# EAGLE schematic ESP32 Watch-2.01 inch V1.0 (EAGLE 9.6.2)
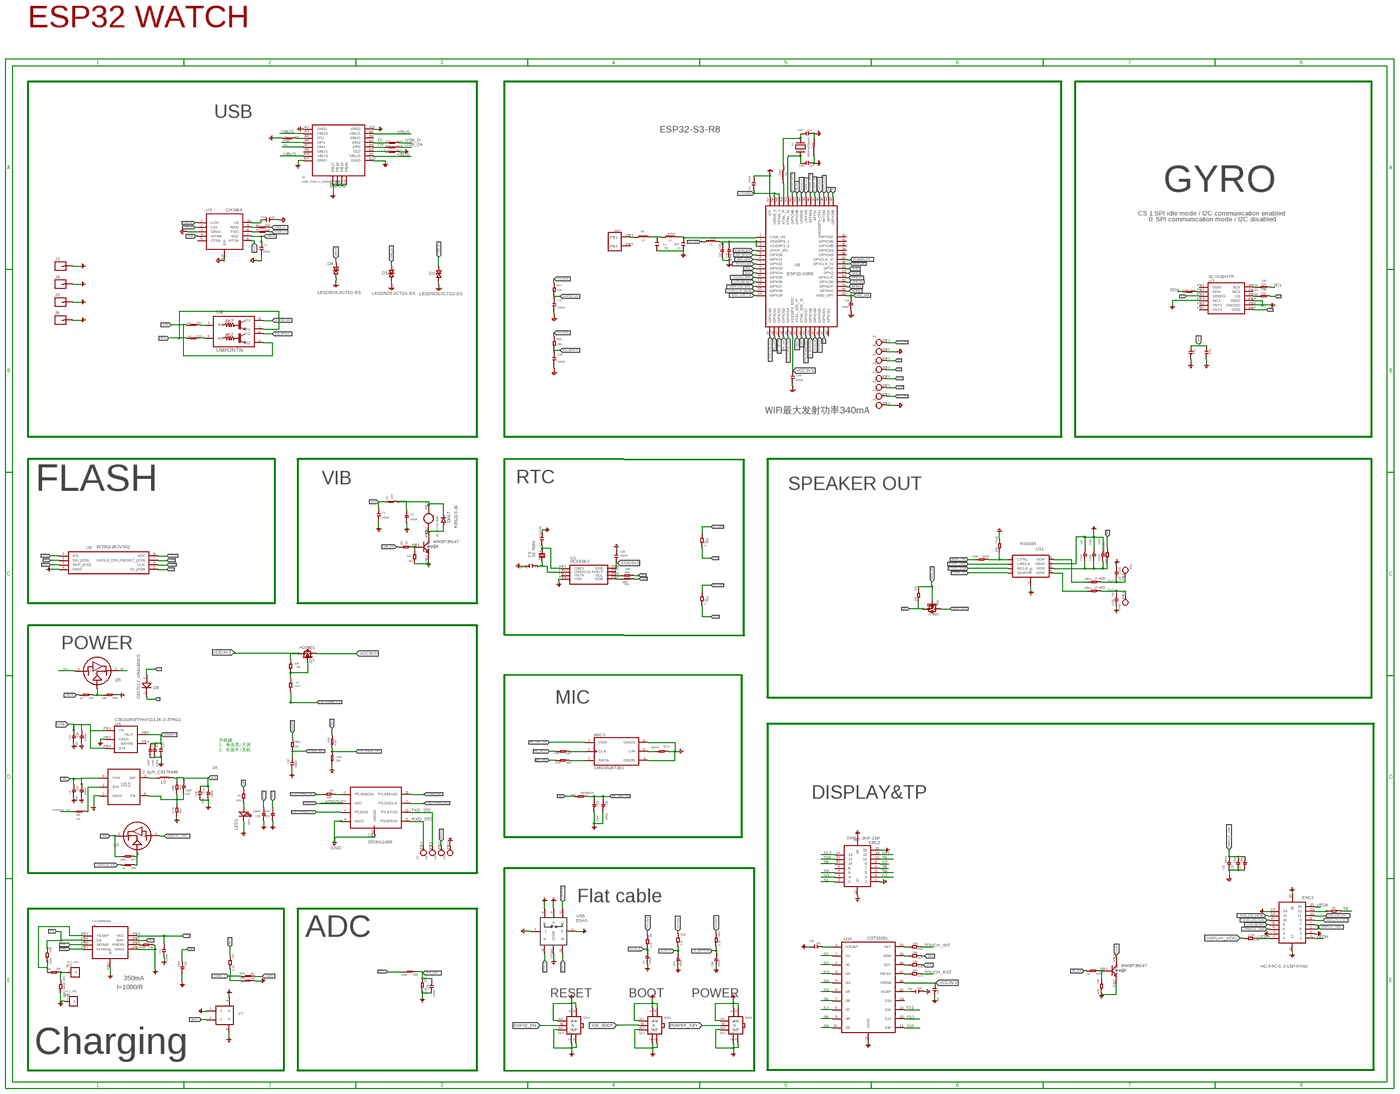
[diagram p0: schematic, sheet 1, overview]
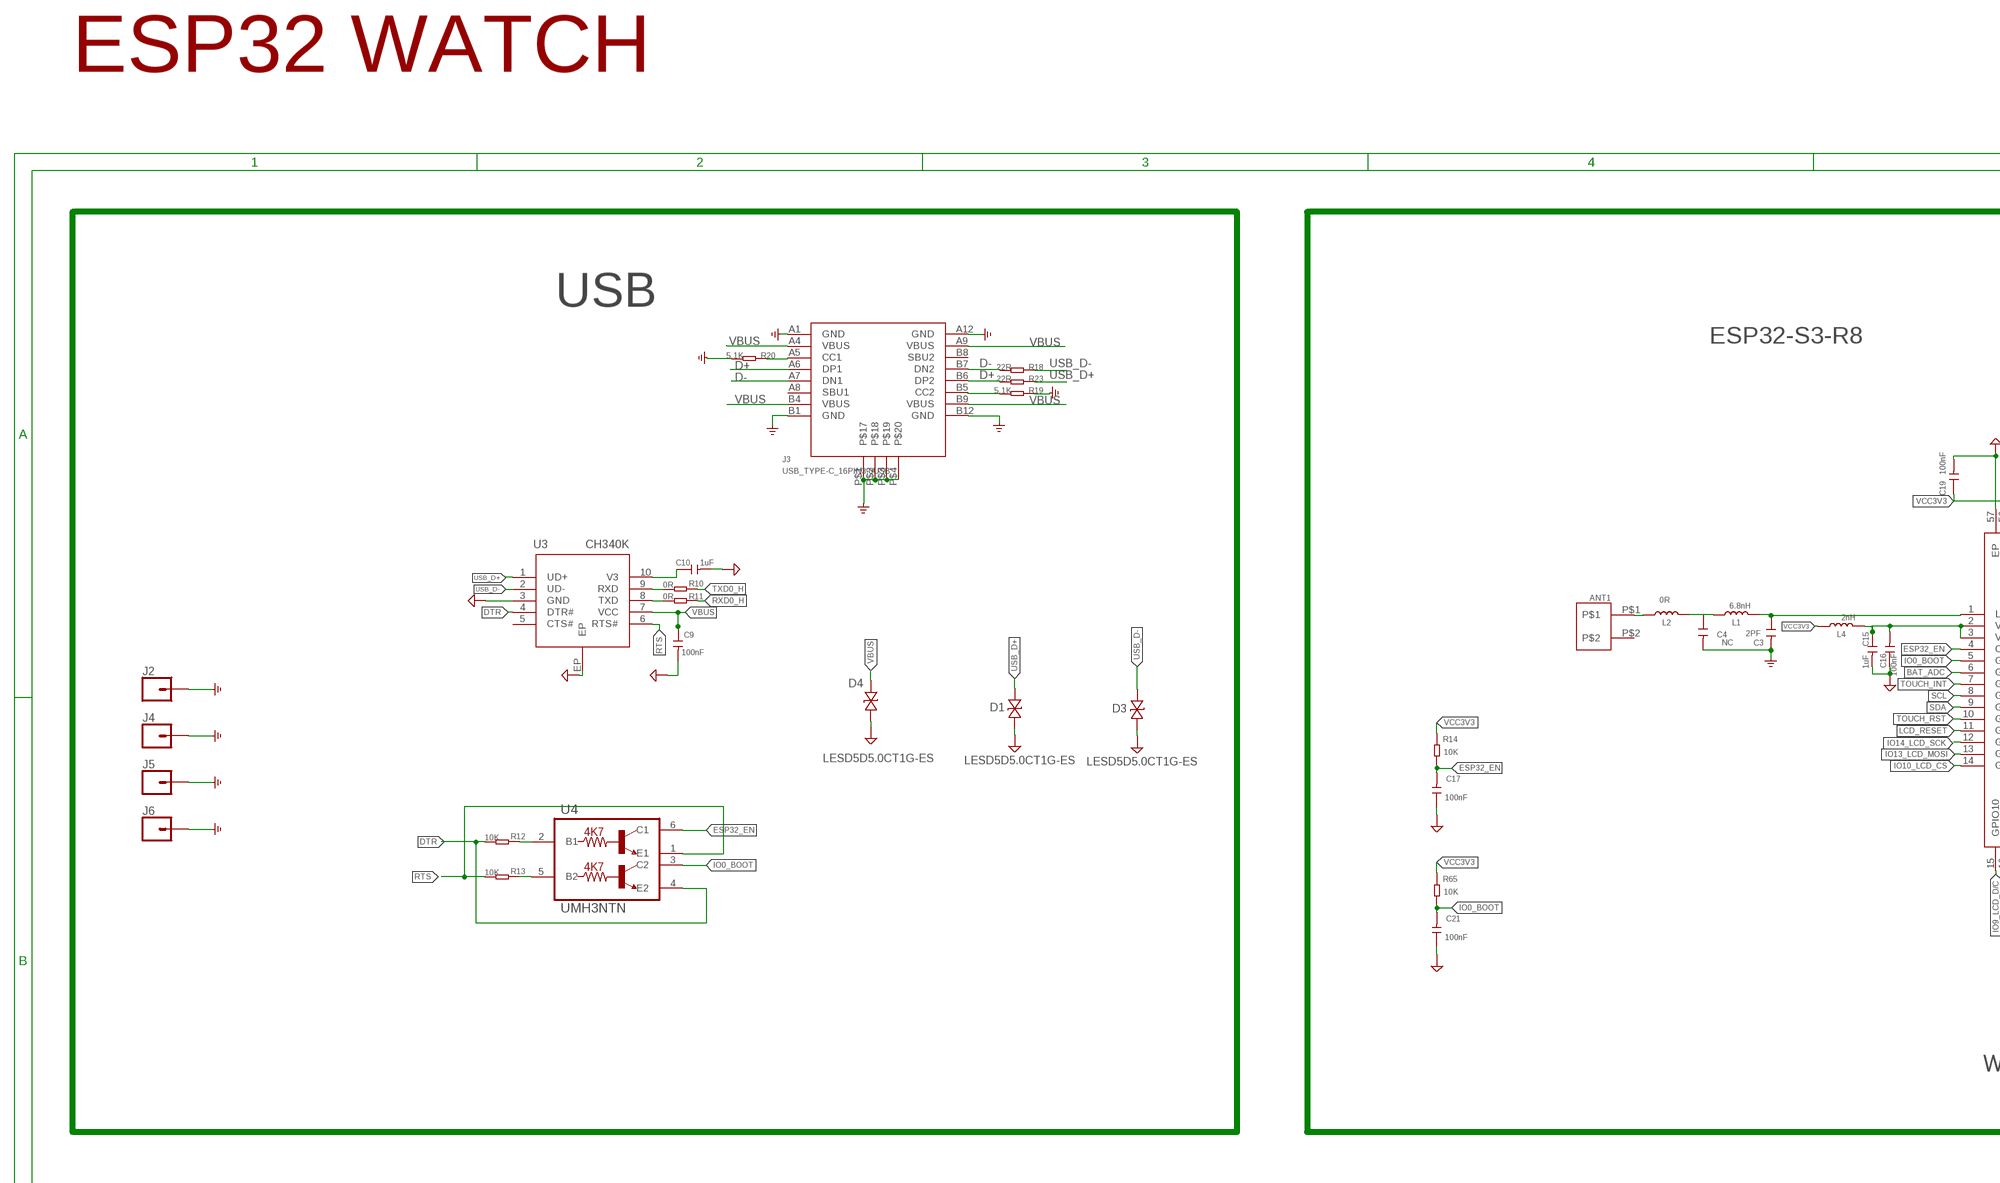
[diagram p1: schematic, sheet 1, part 1 of 4]
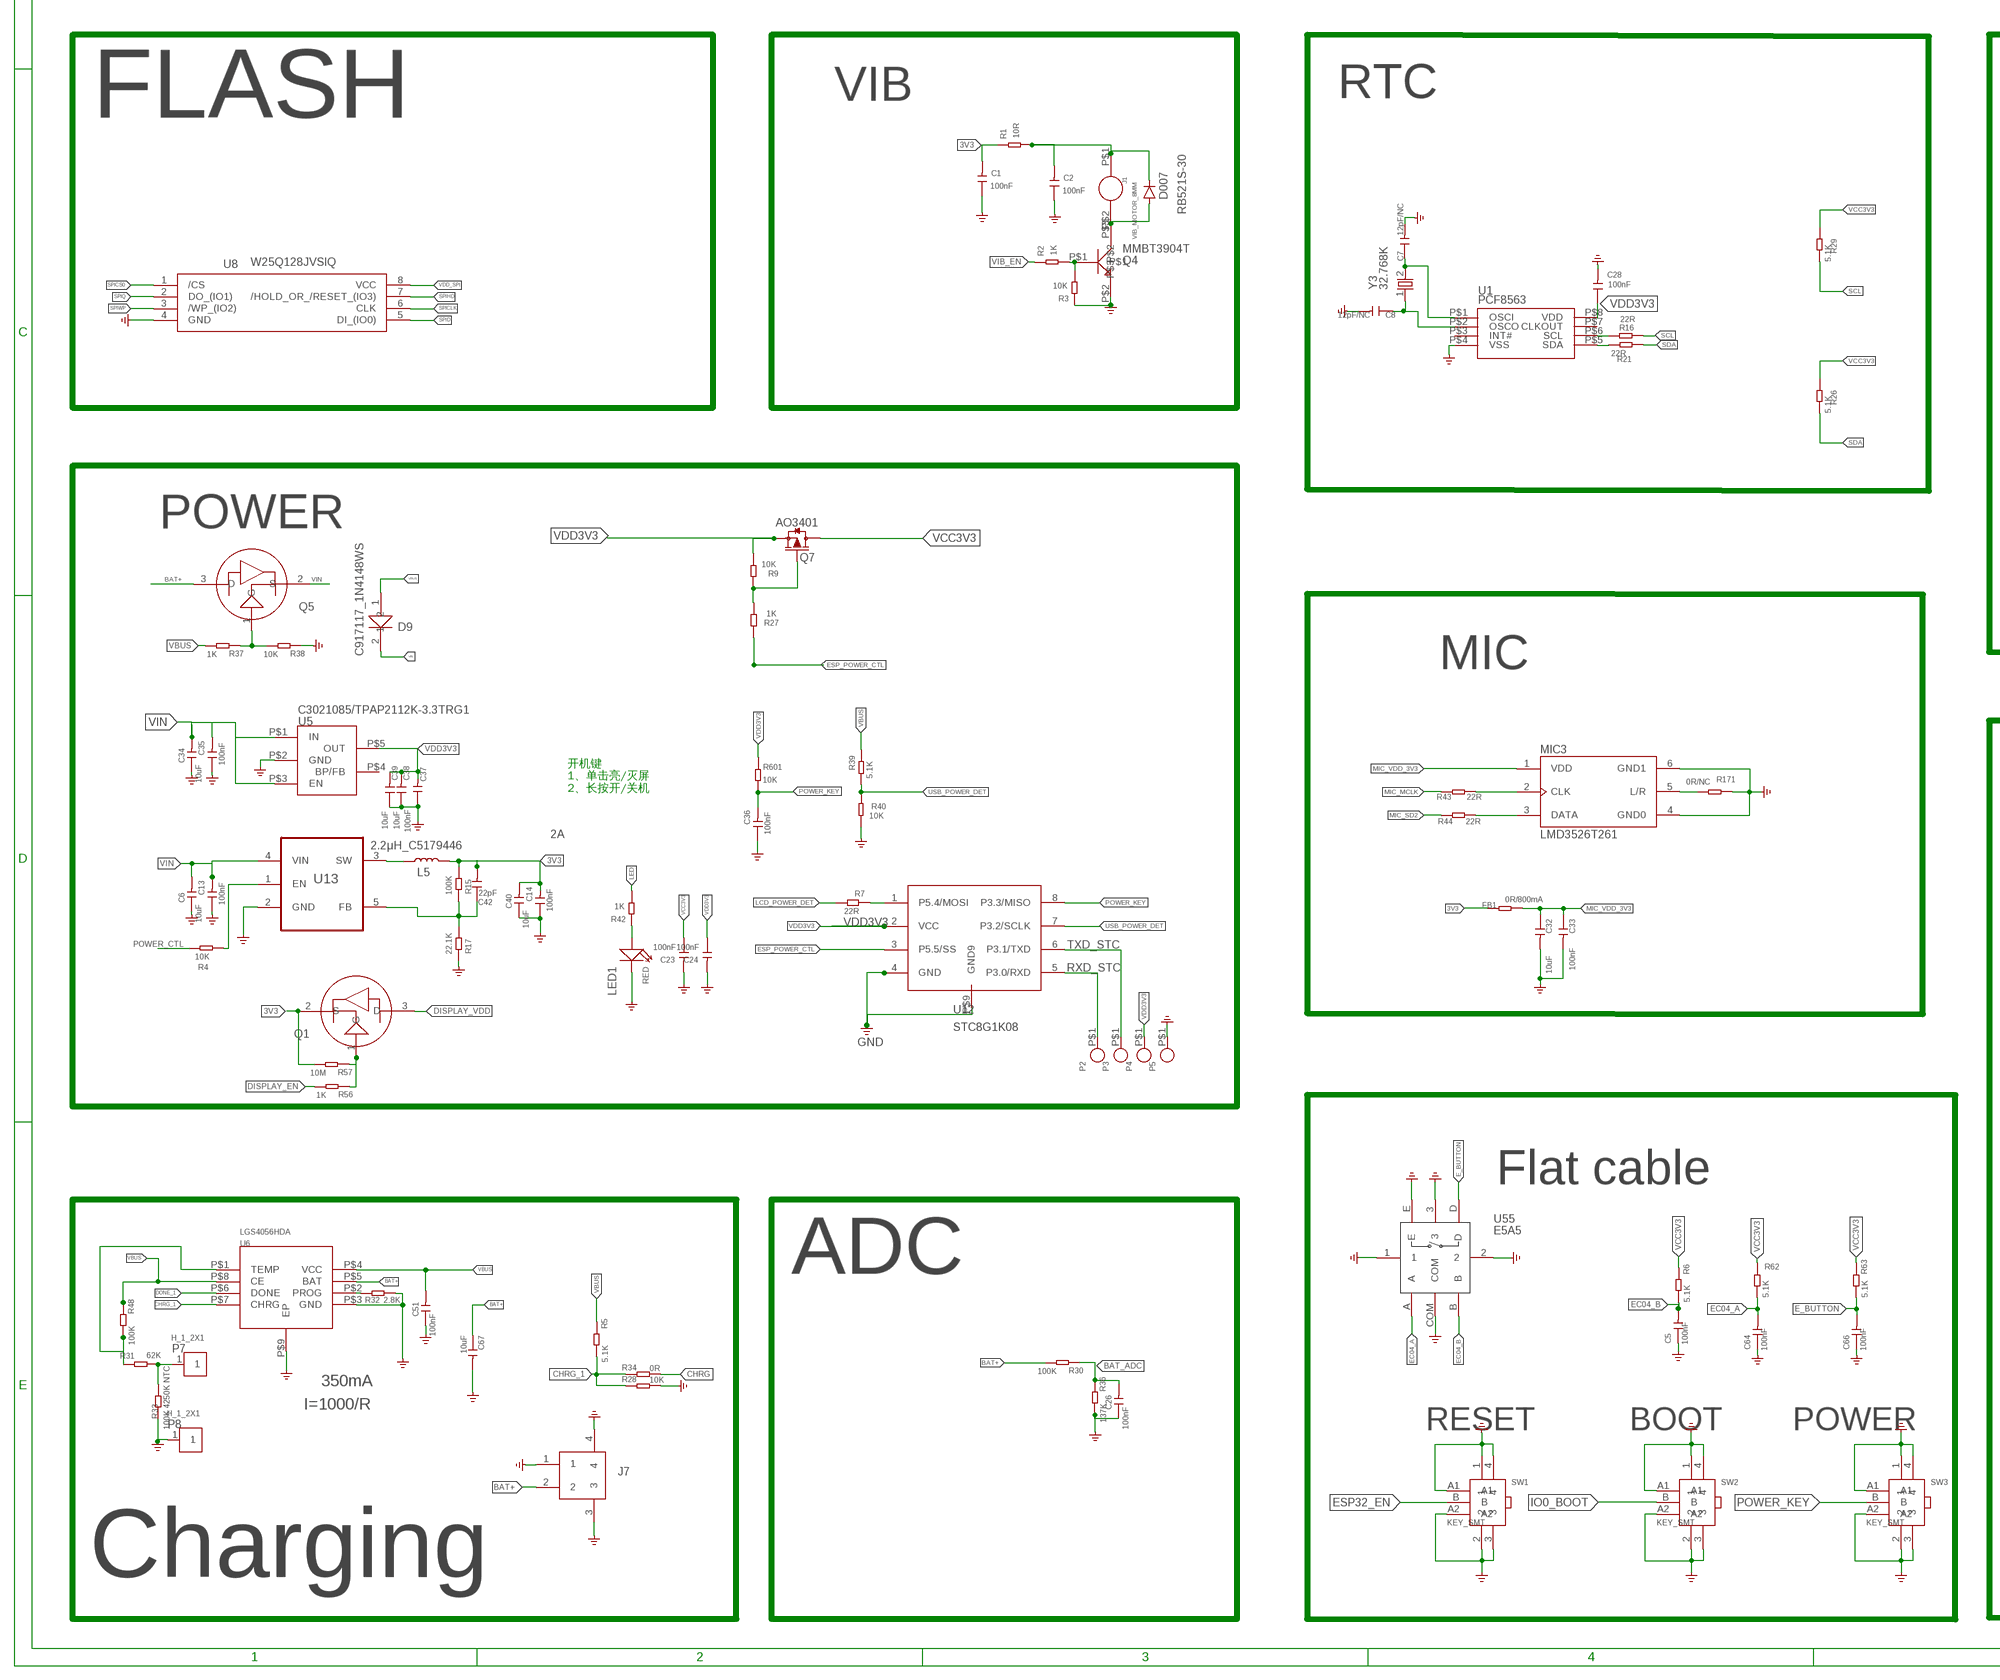
[diagram p2: schematic, sheet 1, part 2 of 4]
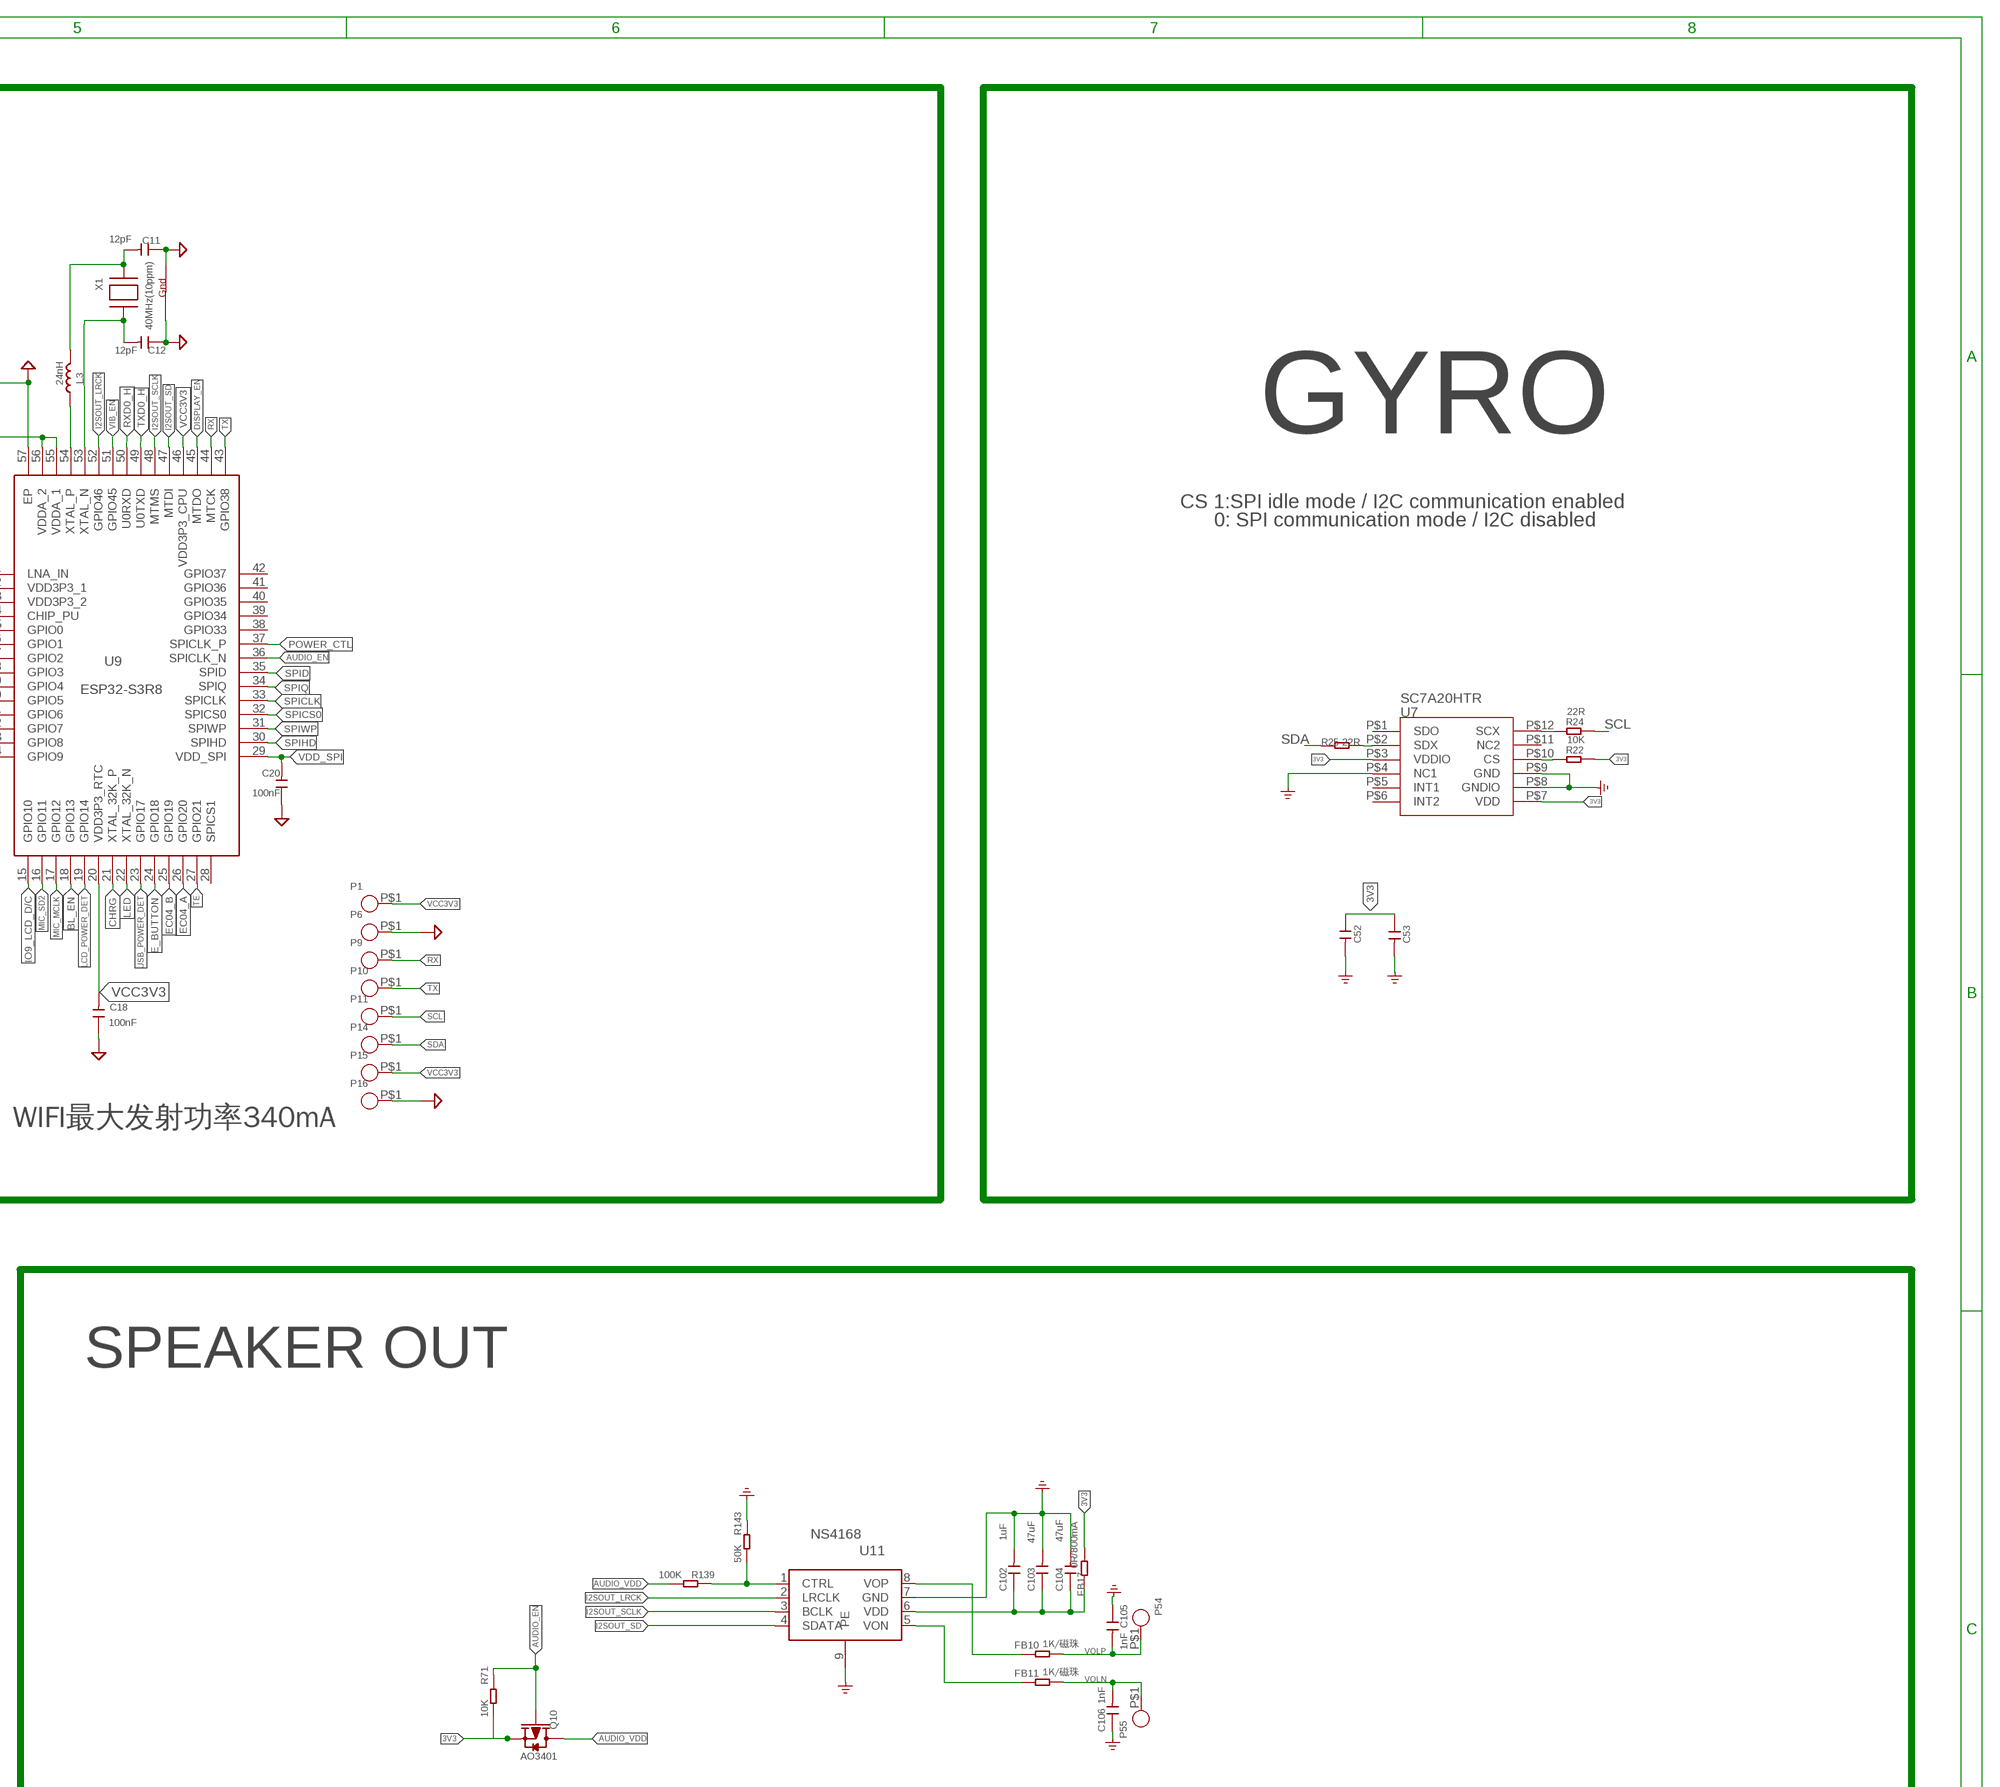
[diagram p3: schematic, sheet 1, part 3 of 4]
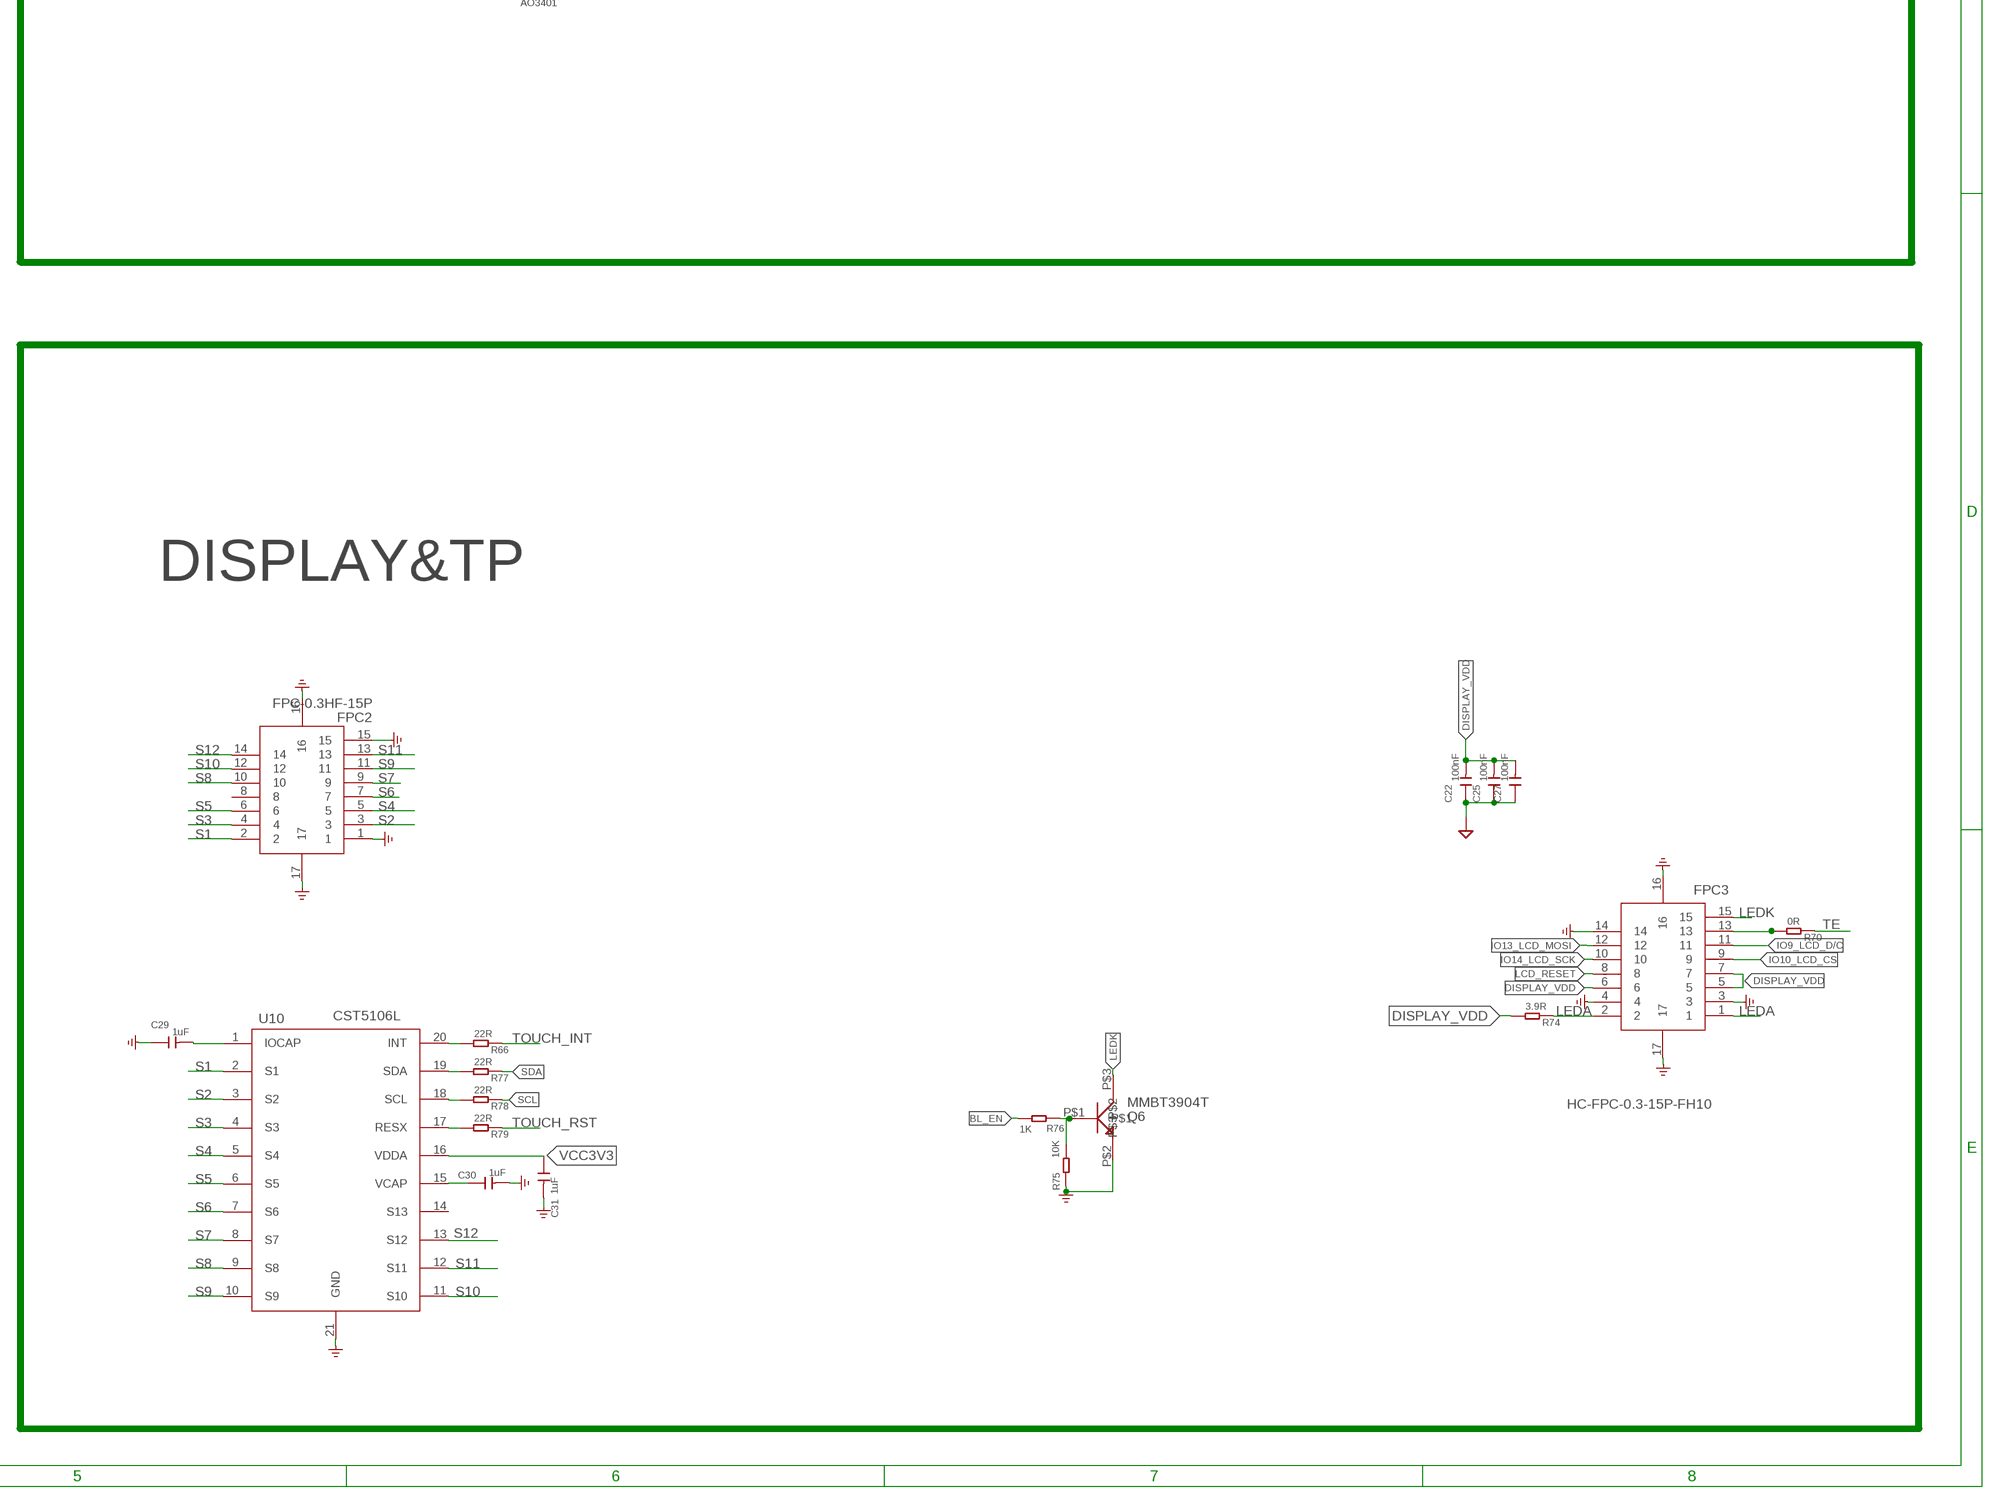
[diagram p4: schematic, sheet 1, part 4 of 4]

## Parts
ANT1  OA-D3  [OA-D3]
C1  100nF  CAPC0402-1  [C0402]
C2  100nF  CAPC0402-1  [C0402]
C3  2PF  CAP-0402  [C0402]
C4  NC  CAP-0402  [C0402]
C5  100nF  CAP-0402  [C0402]
C6  10uF  CAP-0402  [C0402]
C7  12pF/NC  CAP-0402  [C0402]
C8  12pF/NC  CAP-0402  [C0402]
C9  100nF  CAPC0402-1  [C0402]
C10  1uF  CAPC0402-1  [C0402]
C11  12pF  CAPC0402-1  [C0402]
C12  12pF  CAPC0402-1  [C0402]
C13  100nF  CAP-0402  [C0402]
C14  100nF  CAP-0402  [C0402]
C15  1uF  CAPC0402-1  [C0402]
C16  100nF  CAPC0402-1  [C0402]
C17  100nF  CAPC0402-1  [C0402]
C18  100nF  CAPC0402-1  [C0402]
C19  100nF  CAPC0402-1  [C0402]
C20  100nF  CAPC0402-1  [C0402]
C21  100nF  CAPC0402-1  [C0402]
C22  100nF  CAPC0402-1  [C0402]
C23  100nF  CAPC0402-1  [C0402]
C24  100nF  CAPC0402-1  [C0402]
C25  100nF  CAPC0402-1  [C0402]
C26  100nF  CAP-0402  [C0402]
C27  100nF  CAPC0402-1  [C0402]
C28  100nF  CAPC0402-1  [C0402]
C29  1uF  CAPC0402-1  [C0402]
C30  1uF  CAPC0402-1  [C0402]
C31  1uF  CAPC0402-1  [C0402]
C32  10uF  C0402C0402-1  [C0402@1]
C33  100nF  C0402C0402-1  [C0402@1]
C34  10uF  CAP-0402  [C0402]
C35  100nF  CAP-0402  [C0402]
C36  100nF  CAP-0402  [C0402]
C37  100nF  CAP-0402  [C0402]
C38  10uF  CAP-0402  [C0402]
C39  10uF  CAP-0402  [C0402]
C40  10uF  CAP-0402  [C0402]
C42  22pF  CAP  [C0402]
C51  100nF  CAP-0402  [C0402]
C52  100nF  CAP-0402  [C0402]
C53  100nF  CAP-0402  [C0402]
C64  100nF  CAP-0402  [C0402]
C66  100nF  CAP-0402  [C0402]
C67  10uF  DISCRETE-NEW_CAP-0402  [DISCRETE-NEW_C0402]
C102  1uF  C0402C0402-1  [C0402@1]
C103  47uF  CAP-0402  [C0402]
C104  47uF  CAP-0402  [C0402]
C105  1nF  C0402C0402-1  [C0402@1]
C106  1nF  C0402C0402-1  [C0402@1]
D1  LESD5D5.0CT1G-ES  [SOD-523_L1.2-W0.8-LS1.6-BI]
D3  LESD5D5.0CT1G-ES  [SOD-523_L1.2-W0.8-LS1.6-BI]
D4  LESD5D5.0CT1G-ES  [SOD-523_L1.2-W0.8-LS1.6-BI]
D007  RB521S-30  D-SOD523  [SOD523]
D9  C917117_1N4148WS  PICO-2.4_SOD-323  [PICO-2.4_SOD-323]
FB1  0R/800mA  R0402-0402  [R0402]
FB10  1K/磁珠  R0402-0402  [R0402]
FB11  1K/磁珠  R0402-0402  [R0402]
FB17  0R/800mA  R0402-0402  [R0402]
FPC2  FPC-0.3HF-15P  [FPC-0.3HF-15P]
FPC3  HC-FPC-0.3-15P-FH10  [FPC-SMD_HC-FPC-0.3-15P-FH10]
J1  VIB_MOTOR_8MM  [VIB_MOTOR_8MM]
J2  CONN_011X01_2.6MM  [1X01_2.5MM]
J3  USB_TYPE-C_16PIN3.0USB  [KEVIN_3.0TYPEC-SMD]
J4  CONN_011X01_2.6MM  [1X01_2.5MM]
J5  CONN_011X01_2.6MM  [1X01_2.5MM]
J6  CONN_011X01_2.6MM  [1X01_2.5MM]
J7  ZX-SH1.0-2PLT1  [CONN-SMD_2P-P1.00_XUNPU_WAFER-SH1.0-2PWB]
L1  6.8nH  L0402  [L0402]
L2  0R  L0402  [L0402]
L3  24nH  L0402  [L0402]
L4  2nH  L0402  [L0402]
L5  2.2μH_C5179446  4.7μH_SHIELDED_INDUCTOR  [1008(2520)]
LED1  RED  LED'0603'  [LED-0603]
MIC3  LMD3526T261  [SMD_6P_3.5X2.7MM]
P1  TEST_PADPAD-1.5MM  [TEST_PAD-1.5MM]
P2  TEST_PADPAD-1.5MM  [TEST_PAD-1.5MM]
P3  TEST_PADPAD-1.5MM  [TEST_PAD-1.5MM]
P4  TEST_PADPAD-1.5MM  [TEST_PAD-1.5MM]
P5  TEST_PADPAD-1.5MM  [TEST_PAD-1.5MM]
P6  TEST_PADPAD-1.5MM  [TEST_PAD-1.5MM]
P7  H_1_2X1  [H_1_2X1]
P8  H_1_2X1  [H_1_2X1]
P9  TEST_PADPAD-1.5MM  [TEST_PAD-1.5MM]
P10  TEST_PADPAD-1.5MM  [TEST_PAD-1.5MM]
P11  TEST_PADPAD-1.5MM  [TEST_PAD-1.5MM]
P14  TEST_PADPAD-1.5MM  [TEST_PAD-1.5MM]
P15  TEST_PADPAD-1.5MM  [TEST_PAD-1.5MM]
P16  TEST_PADPAD-1.5MM  [TEST_PAD-1.5MM]
P54  TEST_PADPAD-1.5MM  [TEST_PAD-1.5MM]
P55  TEST_PADPAD-1.5MM  [TEST_PAD-1.5MM]
Q1  SI2301  DFN8_P-MOS-SOT23  [DFN8_SOT-23]
Q4  MMBT3904T  MMBT3904T-JSM  [SOT-523]
Q5  SI2301  DFN8_P-MOS-SOT23  [DFN8_SOT-23]
Q6  MMBT3904T  MMBT3904T-JSM  [SOT-523]
Q7  AO3401  MOSFET-PSOT23  [PMOS_SOT23]
Q10  AO3401  MOSFET-PSOT23  [PMOS_SOT23]
R1  10R  RES-0402  [R0402]
R2  1K  RES-0402  [R0402]
R3  10K  RES-0402  [R0402]
R4  10K  RES-0402  [R0402]
R5  5.1K  RES0402  [R0402]
R6  5.1K  RES0402  [R0402]
R7  22R  RESR0402  [R0402]
R9  10K  RESR0402  [R0402]
R10  0R  RES-0402  [R0402]
R11  0R  RES-0402  [R0402]
R12  10K  RES-0402  [R0402]
R13  10K  RES-0402  [R0402]
R14  10K  RES-0402  [R0402]
R15  100K  R  [0402]
R16  22R  RES0402  [R0402]
R17  22.1K  R  [0402]
R18  22R  R0402-1  [0402]
R19  5.1K  R0402-1  [0402]
R20  5.1K  R0402-1  [0402]
R21  22R  RES0402  [R0402]
R22  10K  RES0402  [R0402]
R23  22R  R0402-1  [0402]
R24  22R  RES0402  [R0402]
R25  22R  RES0402  [R0402]
R26  5.1K  RES0402  [R0402]
R27  1K  RESR0402  [R0402]
R28  10K  RES0402  [R0402]
R29  5.1K  RES0402  [R0402]
R30  100K  RES0402  [R0402]
R31  62K  RES0402  [R0402]
R32  2.8K  RES0402  [R0402]
R33  100K 4250K NTC  RES-0402  [R0402]
R34  0R  RES0402  [R0402]
R36  137K  RES0402  [R0402]
R37  1K  RES0402  [R0402]
R38  10K  RES0402  [R0402]
R39  5.1K  RESR0402  [R0402]
R40  10K  RESR0402  [R0402]
R42  1K  RES-0402  [R0402]
R43  22R  R0402-0402  [R0402]
R44  22R  R0402-0402  [R0402]
R48  100K  RES0402  [R0402]
R56  1K  RES0402  [R0402]
R57  10M  RES0402  [R0402]
R62  5.1K  RES0402  [R0402]
R63  5.1K  RES0402  [R0402]
R65  10K  RES-0402  [R0402]
R66  22R  RES-0402  [R0402]
R70  0R  RES-0402  [R0402]
R71  10K  R0402-0402  [R0402]
R74  3.9R  RES-0402  [R0402]
R75  10K  RES0402  [R0402]
R76  1K  RES0402  [R0402]
R77  22R  RES-0402  [R0402]
R78  22R  RES-0402  [R0402]
R79  22R  RES-0402  [R0402]
R139  100K  R0402-0402  [R0402]
R143  50K  R0402-0402  [R0402]
R171  0R/NC  R0402-0402  [R0402]
R601  10K  RESR0402  [R0402]
SW1  KEY_SMT  [SMD_4.1X3.2]
SW2  KEY_SMT  [SMD_4.1X3.2]
SW3  KEY_SMT  [SMD_4.1X3.2]
U1  PCF8563  PCF8563MSOP-8  [MSOP-8]
U3  CH340K  [ESOP-10-EP-150MIL]
U4  UMH3NTN  [SOP65P210X100-6N]
U5  C3021085/TPAP2112K-3.3TRG1  SGM2019  [SOT23-5]
U6  LGS4056HDA  [DFN2X2-8]
U7  SC7A20HTR  [LGA-12(2*2)]
U8  W25Q128JVSIQ  [SOIC127P790X216-8N]
U9  ESP32-S3R8  [QFN40P700X700X90-57N]
U10  CST5106L  AXS5106L  [QFN20-3*3]
U11  NS4168  NS4168-ESOP-8  [NS4168-ESOP-8]
U12  STC8G1K08  [DFN8]
U13  MT3406_C22462728  TLV62569DBVR  [SOT95P280X145-5N]
U55  E5A5  [E5A5-2.35S10]
X1  40MHz(10ppm)  ADAFRUIT_XTAL-4-3225  [ADAFRUIT_NX3225]
Y3  32.768K  NORDIC_NRF_XTAL_32KHZ  [NORDIC_NRF_XTAL_3215_N]

## Nets
3V3: C1.2 C14.2 C40.2 C42.2 C52.1 C53.1 FB1.1 FB17.2 L5.2 Q1.2(S) Q10.2(S) R1.1 R15.1 R22.1 R57.2 R71.2 U7.P$3(VDDIO) U7.P$7(VDD)
AUDIO_EN: Q10.1(G) R71.1 U9.36(SPICLK_N)
AUDIO_VDD: Q10.3(D) R139.2
AUDIO_VDD1: C102.1 C103.1 C104.1 FB17.1 U11.6(VDD)
BAT+: C67.1 J7.2 Q5.3(D) R30.2 U6.P$5(BAT)
BAT_ADC: C26.2 R30.1 R36.1 U9.6(GPIO1)
BL_EN: R76.2 U9.18(GPIO13)
CHRG: R34.2 U9.21(XTAL_32K_P)
CHRG_1: R5.2 R28.1 R34.1 U6.P$7(CHRG)
D+: J3.A6(DP1) J3.B6(DP2) R23.2
D-: J3.A7(DN1) J3.B7(DN2) R18.2
DISPLAY_EN: R56.2 U9.45(MTDO)
DISPLAY_VDD: C22.2 C25.2 C27.2 FPC3.5 FPC3.6 FPC3.7 Q1.3(D) R74.2
DONE_1: U6.P$6(DONE)
DTR: R12.2 U3.4(DTR#) U4.4(E2)
E_BUTTON: C66.2 R63.2 U9.24(GPIO18) U55.D
EC04_A: C64.2 R62.2 U9.26(GPIO20) U55.A
EC04_B: C5.2 R6.2 U9.25(GPIO19) U55.B
ESP32_EN: C17.2 R14.2 SW1.B U4.6(C1) U9.4(CHIP_PU)
ESP_POWER_CTL: R27.2 U12.3(P5.5/SS)
GND: C1.1 C2.1 C3.2 C4.2 C5.1 C6.1 C7.2 C8.2 C9.2 C10.2 C11.1 C12.1 C13.1 C14.1 C15.2 C16.1 C17.1 C18.1 C19.2 C20.1 C21.1 C22.1 C23.2 C24.2 C25.1 C26.1 C27.1 C28.2 C29.1 C30.2 C31.2 C32.2 C33.2 C34.1 C35.1 C36.1 C37.1 C38.1 C39.1 C40.1 C51.1 C52.2 C53.2 C64.1 C66.1 C67.2 C102.2 C103.2 C104.2 C105.1 C106.1 D1.1 D3.1 D4.1 FPC2.1 FPC2.15 FPC2.16 FPC2.17 FPC3.3 FPC3.4 FPC3.14 FPC3.16 FPC3.17 J2.1 J3.A1(GND) J3.A12(GND) J3.B1(GND) J3.B12(GND) J3.P$1 J3.P$2 J3.P$3 J3.P$4 J4.1 J5.1 J6.1 J7.1 J7.3 J7.4 LED1.- MIC3.4(GND0) MIC3.6(GND1) P5.P$1 P6.P$1 P8.1 P16.P$1 Q4.P$2 Q6.P$2 R3.1 R17.2 R19.1 R20.2 R28.2 R32.2 R33.1 R36.2 R38.1 R40.1 R75.1 R143.1 R171.2 SW1.1 SW1.2 SW1.3 SW1.4 SW1.A1 SW1.A2 SW2.1 SW2.2 SW2.3 SW2.4 SW2.A1 SW2.A2 SW3.1 SW3.2 SW3.3 SW3.4 SW3.A1 SW3.A2 U1.P$4(VSS) U3.3(GND) U3.EP U5.P$2(GND) U6.P$3(GND) U6.P$9(EP) U7.P$4(NC1) U7.P$8(GNDIO) U7.P$9(GND) U8.4(GND) U9.57(EP) U10.21(GND) U11.7(GND) U11.9(PE) U12.4(GND) U12.P$9(GND9) U13.2(GND) U55.1 U55.2 U55.3 U55.COM U55.E X1.2(G2) X1.4(G1)
I2SOUT_LRCK: U9.52(GPIO46) U11.2(LRCLK)
I2SOUT_SCLK: U9.48(MTMS) U11.3(BCLK)
I2SOUT_SD: U9.47(MTDI) U11.4(SDATA)
IO0_BOOT: C21.2 R65.2 SW2.B U4.3(C2) U9.5(GPIO0)
IO9_LCD_D/C: FPC3.11 U9.15(GPIO10)
IO10_LCD_CS: FPC3.9 U9.14(GPIO9)
IO13_LCD_MOSI: FPC3.12 U9.13(GPIO8)
IO14_LCD_SCK: FPC3.10 U9.12(GPIO7)
LCD_POWER_DET: R7.2 U9.19(GPIO14)
LCD_RESET: FPC3.8 U9.11(GPIO6)
LED: R42.2 U9.22(XTAL_32K_N)
LEDA: FPC3.1 FPC3.2 R74.1
LEDK: FPC3.15 Q6.P$3
MIC_MCLK: R43.2 U9.17(GPIO12)
MIC_SD2: R44.1 U9.16(GPIO11)
MIC_VDD_3V3: C32.1 C33.1 FB1.2 MIC3.1(VDD)
N$1 [50R]: ANT1.P$1 L2.2
N$2: Q4.P$1 R2.2 R3.2
N$3: C2.2 D007.C J1.P$1 R1.2
N$4: Q6.P$1 R75.2 R76.1
N$5 [50R]: C3.1 L1.1 U9.1(LNA_IN)
N$6 [50R]: C4.1 L1.2 L2.1
N$7: C8.1 U1.P$2(OSCO) Y3.1
N$8: C7.1 U1.P$1(OSCI) Y3.2
N$9: D007.A J1.P$2 Q4.P$3
N$10: R4.2 U13.1(EN)
N$11: L5.1 U13.3(SW)
N$12: R10.2 U3.9(RXD)
N$14: R11.2 U3.8(TXD)
N$15: R12.1 U4.2(B1)
N$16: C10.1 U3.10(V3)
N$17: R13.1 U4.5(B2)
N$18: MIC3.2(CLK) R43.1
N$19: L3.2 U9.54(XTAL_P)
N$20: Q1.1(G) R56.1 R57.1
N$21: J3.A5(CC1) R20.1
N$22: C12.2 U9.53(XTAL_N) X1.3(X2)
N$23: C11.2 L3.1 X1.1(X1)
N$24: FPC3.13 R70.2
N$25: C42.1 R15.2 R17.1 U13.5(FB)
N$26: MIC3.5(L/R) R171.1
N$28: C29.2 U10.1(IOCAP)
N$29: R7.1 U12.1(P5.4/MOSI)
N$30: C30.1 U10.15(VCAP)
N$31: R66.2 U10.20(INT)
N$32: R77.2 U10.19(SDA)
N$33: J3.B5(CC2) R19.2
N$35: LED1.+ R42.1
N$36: R22.2 U7.P$10(CS)
N$37: R78.2 U10.18(SCL)
N$39: R16.2 U1.P$6(SCL)
N$40: R21.2 U1.P$5(SDA)
N$41: R24.2 U7.P$12(SCX)
N$42: R25.2 U7.P$2(SDX)
N$45: FB10.1 U11.8(VOP)
N$46: FB11.1 U11.5(VON)
N$48: MIC3.3(DATA) R44.2
N$51: R139.1 R143.2 U11.1(CTRL)
N$60: R31.1 R48.2 U6.P$1(TEMP)
N$61: P7.1 R31.2 R33.2
N$63: R32.1 U6.P$2(PROG)
N$67: Q5.1(G) R37.1 R38.2
N$76: R79.2 U10.17(RESX)
N$122: Q7.1(G) R9.2 R27.1
POWER_CTL: R4.1 U9.37(SPICLK_P)
POWER_KEY: C36.2 R601.1 SW3.B U12.8(P3.3/MISO)
RTS: R13.2 U3.6(RTS#) U4.1(E1)
RX: P9.P$1 U9.44(MTCK)
RXD0_H: R11.1 U9.50(U0RXD)
RXD_STC: P2.P$1 U12.5(P3.0/RXD)
S1: FPC2.2 U10.2(S1)
S2: FPC2.3 U10.3(S2)
S3: FPC2.4 U10.4(S3)
S4: FPC2.5 U10.5(S4)
S5: FPC2.6 U10.6(S5)
S6: FPC2.7 U10.7(S6)
S7: FPC2.9 U10.8(S7)
S8: FPC2.10 U10.9(S8)
S9: FPC2.11 U10.10(S9)
S10: FPC2.12 U10.11(S10)
S11: FPC2.13 U10.12(S11)
S12: FPC2.14 U10.13(S12)
SCL: P11.P$1 R16.1 R24.1 R29.2 R78.1 U9.8(GPIO3)
SDA: P14.P$1 R21.1 R25.1 R26.2 R77.1 U9.9(GPIO4)
SPICLK: U8.6(CLK) U9.33(SPICLK)
SPICS0: U8.1(/CS) U9.32(SPICS0)
SPID: U8.5(DI_(IO0)) U9.35(SPID)
SPIHD: U8.7(/HOLD_OR_/RESET_(IO3)) U9.30(SPIHD)
SPIQ: U8.2(DO_(IO1)) U9.34(SPIQ)
SPIWP: U8.3(/WP_(IO2)) U9.31(SPIWP)
TE: R70.1 U9.27(GPIO21)
TOUCH_INT: R66.1 U9.7(GPIO2)
TOUCH_RST: R79.1 U9.10(GPIO5)
TX: P10.P$1 U9.43(GPIO38)
TXD0_H: R10.1 U9.49(U0TXD)
TXD_STC: P3.P$1 U12.6(P3.1/TXD)
USB_D+: D1.2 R23.1 U3.1(UD+)
USB_D-: D3.2 R18.1 U3.2(UD-)
USB_POWER_DET: R39.2 R40.2 U9.23(GPIO17) U12.7(P3.2/SCLK)
VBUS: C9.1 C51.2 D4.2 D9.1 J3.A4(VBUS) J3.A9(VBUS) J3.B4(VBUS) J3.B9(VBUS) R5.1 R37.2 R39.1 R48.1 U3.7(VCC) U6.P$4(VCC) U6.P$8(CE)
VCC3V3: C18.2 C19.1 C23.1 C31.1 L4.2 P1.P$1 P15.P$1 Q7.3(D) R6.1 R14.1 R26.1 R29.1 R62.1 R63.1 R65.1 U9.20(VDD3P3_RTC) U9.46(VDD3P3_CPU) U9.55(VDDA_1) U9.56(VDDA_2) U10.16(VDDA)
VDD3P3: C15.1 C16.2 L4.1 U9.2(VDD3P3_1) U9.3(VDD3P3_2)
VDD3V3: C24.1 C28.1 C37.2 C38.2 C39.2 P4.P$1 Q7.2(S) R9.1 R601.2 U1.P$8(VDD) U5.P$5(OUT) U12.2(VCC)
VDD_SPI: C20.2 U8.8(VCC) U9.29(VDD_SPI)
VIB_EN: R2.1 U9.51(GPIO45)
VIN: C6.2 C13.2 C34.2 C35.2 D9.2 Q5.2(S) U5.P$1(IN) U5.P$3(EN) U13.4(VIN)
VOLN: C106.2 FB11.2 P55.P$1
VOLP: C105.2 FB10.2 P54.P$1
Unconnected: ANT1.P$2 FPC2.8 J3.A8(SBU1) J3.B8(SBU2) U1.P$3(INT#) U1.P$7(CLKOUT) U3.5(CTS#) U5.P$4(BP/FB) U7.P$1(SDO) U7.P$5(INT1) U7.P$6(INT2) U7.P$11(NC2) U9.28(SPICS1) U9.38(GPIO33) U9.39(GPIO34) U9.40(GPIO35) U9.41(GPIO36) U9.42(GPIO37) U10.14(S13)

## Notes on the sheet
- ESP32 WATCH
- USB
- ESP32-S3-R8
- GYRO
- CS 1:SPI idle mode / I2C communication enabled
- 0: SPI communication mode / I2C disabled
- WIFI最大发射功率340mA
- VIB | RTC
- FLASH | SPEAKER OUT
- POWER
- MIC
- 开机键
  1、单击亮/灭屏
  2、长按开/关机
- 2A
- DISPLAY&TP
- Flat cable
- ADC
- 350mA
- I=1000/R
- RESET | BOOT | POWER
- Charging

## Library data of the parts
ANT1 = RC:OA-D3
C1 C2 C9-C12 C15-C25 C27-C31 = CrowPanel_Advance_HMI:CAP*
C3 C4 C42 C103 C104 = RC:CAP: Ceramic Capacitors
C5-C8 C13 C14 C26 C34-C40 C51-C53 C64 C66 = MY_LIB:CAP: Ceramic Capacitors
C32 C33 C102 C105 C106 = RC:C0402
C67 = Xadow-GPS-v2:DISCRETE-NEW_CAP: Ceramic Capacitors
D1 D3 D4 = LESD5D5.0CT1G-ES:LESD5D5.0CT1G-ES
D007 = MY_LIB:D-SOD523
D9 = CrowPanel Pico Display-2.4_V1.0_240412:PICO-2.4_SOD-323
FB1 FB10 FB11 FB17 R43 R44 R71 R139 R143 R171 = RC:R0402
FPC2 = MY_LIB:FPC-0.3HF-15P
FPC3 = FPC:HC-FPC-0.3-15P-FH10
J1 = RC:VIB_MOTOR_8MM
J2 J4-J6 = SparkFun-Connectors:CONN_01: Single connection point. Often used as Generic Header-pin footprint for 0.1 inch spaced/style header connections On any of the 0.1 inch spaced packages, you can populate with these: Break Away Headers - Straight <https://www.sparkfun.com/products/116> (PRT-00116) Break Away Male Headers - Right Angle <https://www.sparkfun.com/products/553> (PRT-00553) Female Headers <https://www.sparkfun.com/products/115> (PRT-00115) Break Away Headers - Machine Pin <https://www.sparkfun.com/products/117> (PRT-00117) Break Away Female Headers - Swiss Machine Pin <https://www.sparkfun.com/products/743> (PRT-00743) This device is also useful as a general connection point to wire up your design to another part of your project. Our various solder wires solder well into these plated through hole pads. Hook-Up Wire - Assortment (Stranded, 22 AWG) <https://www.sparkfun.com/products/11375> (PRT-11375) Hook-Up Wire - Assortment (Solid Core, 22 AWG) <https://www.sparkfun.com/products/11367> (PRT-11367) View the entire wire category on our website here <https://www.sparkfun.com/categories/141> Special notes: SMTSO-256-ET is a "flush mount" nut for a 4-40 screw. We mostly use this on specialty testbeds; it is a nice way to connect hardware to your PCB at an adjustable hieght. Also note, the SNAP packages are for using a snappable style connector. We sell a baggie of snaps and they are also used on two LilyPad designs: Snap Assortment - 30 pack (male and female) <https://www.sparkfun.com/products/11347> (DEV-11347) LilyPad Arduino SimpleSnap <https://www.sparkfun.com/products/10941> (DEV-10941) LilyPad SimpleSnap Protoboard <https://www.sparkfun.com/products/10940> (DEV-10940)
J3 = SparkFun-Connectors:USB_TYPE-C_16PIN
J7 = Mini PC Case:ZX-SH1.0-2PLT
L1-L3 = RC:L*
L4 = LoraWAN_Gateway_Mainboard:L*
L5 = SparkFun-Coils:4.7μH_SHIELDED_INDUCTOR: 4.7uH Inductor 4.7uH 1.4A 50mOhm 1008(2520) Package Shielded; PROD_ID: NDUC-14880
LED1 = Discrete:LED*; LED1: RED
MIC3 = RC:LMD3526T261
P1 P6 P9-P11 P14-P16 P54 P55 = CrowPanel_Advance_HMI:TEST_PAD*
P2-P5 = RC:TEST_PAD*
P7 P8 = MY_LIB:H_1_2X1
Q1 Q5 = CrowPanel Pico Display-2.4_V1.0_240412:DFN8_P-MOS-SOT23
Q4 Q6 = myself:MMBT3904T-JSM
Q7 = Brian:MOSFET-P: IRLL014: http://www.vishay.com/docs/91319/sihll014.pdf
Q10 = CrowPanel_Advance_HMI:MOSFET-P: IRLL014: http://www.vishay.com/docs/91319/sihll014.pdf
R1-R4 R10-R14 R42 R65 R66 R70 R74 R77-R79 = CrowPanel_Advance_HMI:RES*
R5 R6 R16 R21 R22 R24-R26 R28-R32 R34 R36-R38 R48 R56 R57 R62 R63 R75 R76 = MY_LIB:RES0402
R7 R9 R27 R39 R40 R601 = Brian:RES*
R15 R17 = RC:R*
R18-R20 R23 = WGH:R0402-1
R33 = LoraWAN_Gateway_Mainboard:RES*
SW1-SW3 = RC:KEY_SMT
U1 = myself:PCF8563
U3 = sale:CH340K
U4 = UMH3NTN:UMH3NTN: Dual NPN BJT with 4.7K Base resistor Datasheet <https://fscdn.rohm.com/en/products/databook/datasheet/discrete/transistor/digital/umh3ntn-e.pdf> BUY NOW <https://www.digikey.ca/en/products/detail/rohm-semiconductor/umh3ntn/659279> Check availability <https://pricing.snapeda.com/parts/UMH3NTN/Rohm/view-part?ref=eda>; AVAILABILITY: In Stock; CHECK_PRICES: https://www.snapeda.com/parts/UMH3NTN/Rohm/view-part/?ref=eda; DESCRIPTION: Pre-Biased Bipolar Transistor (BJT) 2 NPN - Pre-Biased (Dual) 50V 100mA 250MHz 150mW Surface Mount UMT6; MF: Rohm; MP: UMH3NTN; PACKAGE: SOT-363 Rohm; PRICE: None; PURCHASE-URL: https://www.snapeda.com/api/url_track_click_mouser/?unipart_id=355768&manufacturer=Rohm&part_name=UMH3NTN&search_term=umh3n; SNAPEDA_LINK: https://www.snapeda.com/parts/UMH3NTN/Rohm/view-part/?ref=snap
U5 = myself:SGM2019
U6 = myself:LGS4056HDA
U7 = myself:SC7A20HTR
U8 = W25Q128JVSIQ:W25Q128JVSIQ: 128M-bit Serial Flash Memory with uniform 4KB sectors and Dual/Quad SPI Source: Datasheet <https://www.winbond.com/hq/search-resource-file.jsp?partNo=W25Q128JVSIQ&type=datasheet>; ARROW_PART_NUMBER: W25Q128JVSIQ; ARROW_PRICE-STOCK: https://www.arrow.com/en/products/w25q128jvsiq/winbond-electronics?utm_currency=USD&region=nac; DESCRIPTION: 128M-bit Serial Flash Memory with uniform 4KB sectors and Dual/Quad SPI; HEIGHT: 2.16mm; MANUFACTURER_NAME: Winbond; MANUFACTURER_PART_NUMBER: W25Q128JVSIQ; MOUSER_PART_NUMBER: 454-W25Q128JVSIQ; MOUSER_PRICE-STOCK: https://www.mouser.co.uk/ProductDetail/Winbond/W25Q128JVSIQ?qs=qSfuJ%252Bfl%2Fd6tLXvPR4fl9w%3D%3D
U9 = ESP32-S3R8:ESP32-S3R8: WiFi Modules - 802.11 SMD IC, Dual-Core MCU, Wi-Fi 2.4G & BLE 5.0 Combo, 8 MB Octal SPI PSRAM, QFN 56-pin, 7*7 mm Source: Datasheet <https://www.espressif.com/sites/default/files/documentation/esp32-s3_datasheet_en.pdf>; DESCRIPTION: WiFi Modules - 802.11 SMD IC, Dual-Core MCU, Wi-Fi 2.4G & BLE 5.0 Combo, 8 MB Octal SPI PSRAM, QFN 56-pin, 7*7 mm; HEIGHT: 0.9mm; MANUFACTURER_NAME: Espressif Systems; MANUFACTURER_PART_NUMBER: ESP32-S3R8; MOUSER_PART_NUMBER: 356-ESP32-S3R8; MOUSER_PRICE-STOCK: https://www.mouser.co.uk/ProductDetail/Espressif-Systems/ESP32-S3R8?qs=Rp5uXu7WBW%252Bto4RqH8CMng%3D%3D
U10 = MY_LIB:AXS5106L
U11 = STC_MCUSTC8G1K08A:NS4168-ESOP-8
U12 = DFN8:STC8G1K08
U13 = TLV62569DBVR:TLV62569DBVR: Check availability <https://pricing.snapeda.com/parts/TLV62569DBVR/Texas%20Instruments/view-part?ref=eda>; AVAILABILITY: In Stock; CHECK_PRICES: https://www.snapeda.com/parts/TLV62569DBVR/Texas+Instruments/view-part/?ref=eda; DESCRIPTION: 2.5V-5.5V input, 2-A high efficiency step-down buck converter in SOT23 and SOT563 package; MF: Texas Instruments; MP: TLV62569DBVR; PACKAGE: SOT-23-5 Texas Instruments; PRICE: None; SNAPEDA_LINK: https://www.snapeda.com/parts/TLV62569DBVR/Texas+Instruments/view-part/?ref=snap
U55 = RC:E5A5
X1 = ESP32-S3 4.2“ EINK V1.3:ADAFRUIT_XTAL-4: Classic 4-pin 3.2 x 2.5mm crystal
Y3 = nRF52832_MCU:NORDIC_NRF_XTAL_32KHZ

## Net classes
1 50R: width 0.156 mm, clearance 0.457 mm